# EasyEDA Pro project ProPrj_3x3motorFPGA_2025-06-22.epro, schematic Current_shunt_ADC
Create Date: 2025-06-07; Page Name: P1; Project Name: 3x3motorFPGA; Schematic Name: Current_shunt_ADC; Update Date: 2025-06-09; Company: EasyEDA.com; Page Size: A4; Version: V1.0
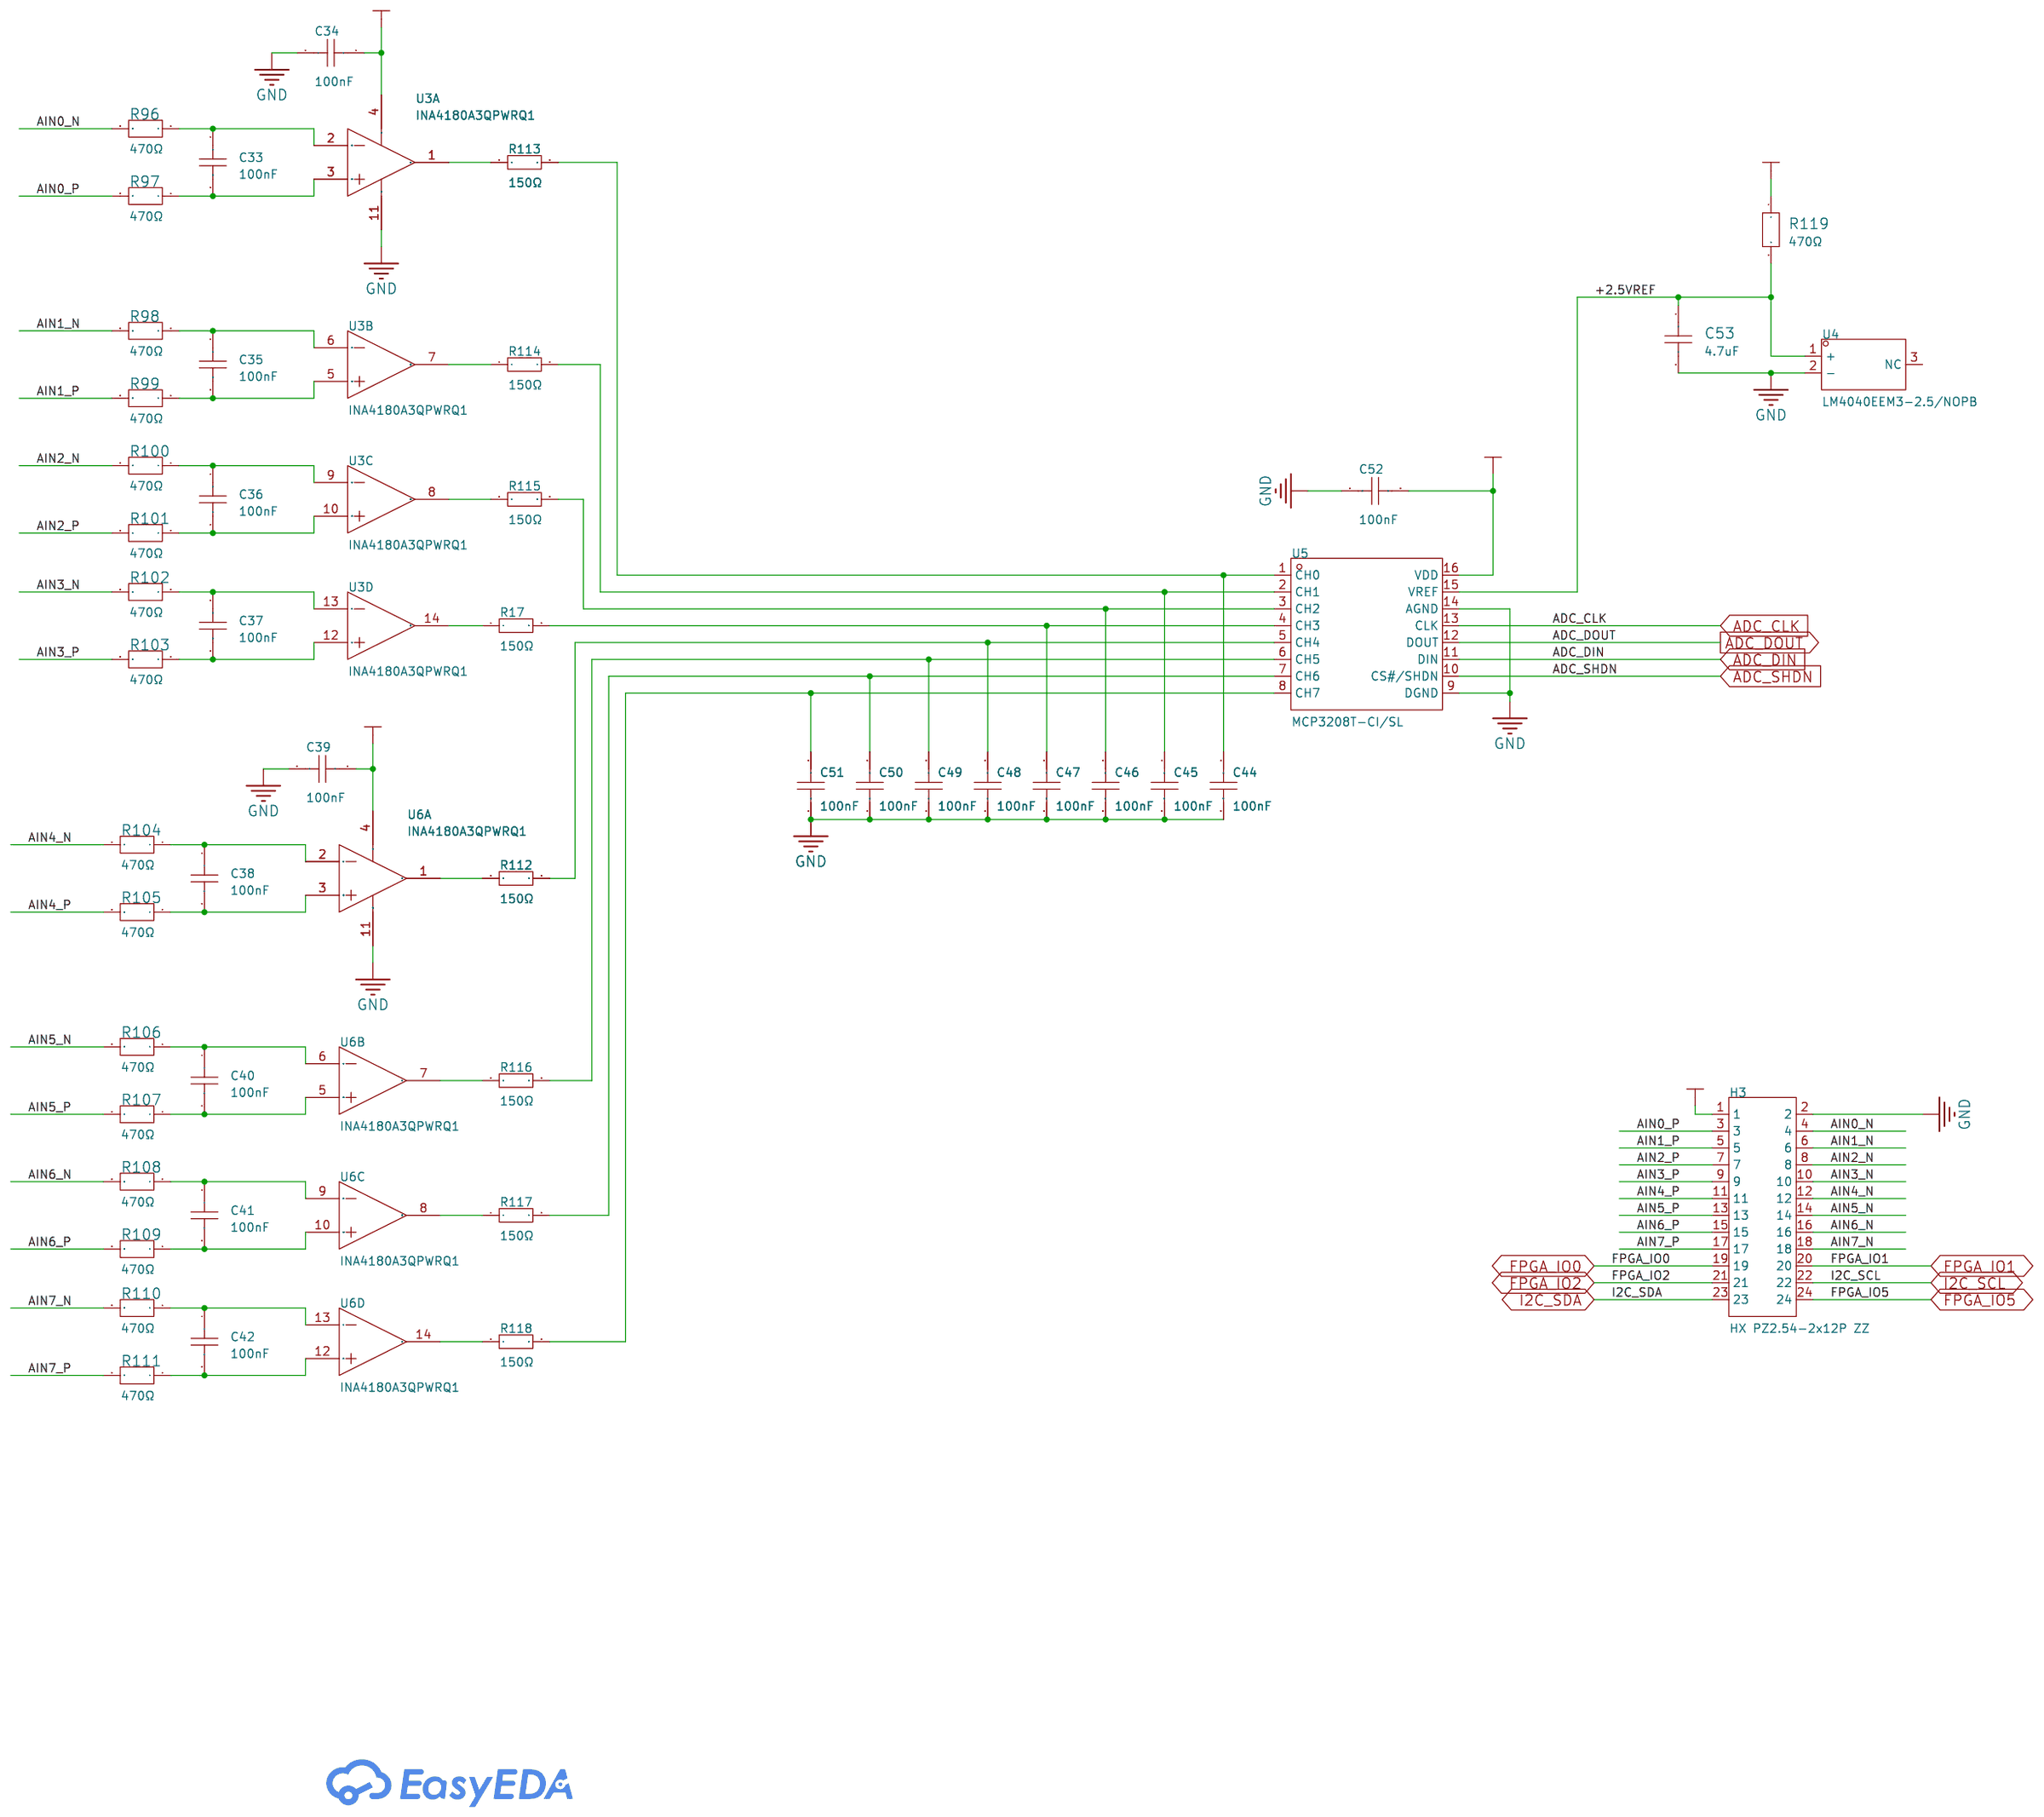
[diagram p2: schematic sheet]

## Parts
C33  100nF  [C0402]
C34  100nF  [C0402]
C35  100nF  [C0402]
C36  100nF  [C0402]
C37  100nF  [C0402]
C38  100nF  [C0402]
C39  100nF  [C0402]
C40  100nF  [C0402]
C41  100nF  [C0402]
C42  100nF  [C0402]
C44  100nF  [C0402]
C45  100nF  [C0402]
C46  100nF  [C0402]
C47  100nF  [C0402]
C48  100nF  [C0402]
C49  100nF  [C0402]
C50  100nF  [C0402]
C51  100nF  [C0402]
C52  100nF  [C0402]
C53  4.7uF  [C0402]
H3  HX PZ2.54-2x12P ZZ  [HDR-TH_24P-P2.54-V-M-R2-C12-S2.54]
R17  150Ω  [R0402]
R96  470Ω  [R0402]
R97  470Ω  [R0402]
R98  470Ω  [R0402]
R99  470Ω  [R0402]
R100  470Ω  [R0402]
R101  470Ω  [R0402]
R102  470Ω  [R0402]
R103  470Ω  [R0402]
R104  470Ω  [R0402]
R105  470Ω  [R0402]
R106  470Ω  [R0402]
R107  470Ω  [R0402]
R108  470Ω  [R0402]
R109  470Ω  [R0402]
R110  470Ω  [R0402]
R111  470Ω  [R0402]
R112  150Ω  [R0402]
R113  150Ω  [R0402]
R114  150Ω  [R0402]
R115  150Ω  [R0402]
R116  150Ω  [R0402]
R117  150Ω  [R0402]
R118  150Ω  [R0402]
R119  470Ω  [R0402]
U3  INA4180A3QPWRQ1  [TSSOP-14_L5.0-W4.4-P0.65-LS6.4-BL]  (sections 1,2,3,4)
U4  LM4040EEM3-2.5/NOPB  [SOT-23-3_L2.9-W1.3-P1.90-LS2.4-BR]
U5  MCP3208T-CI/SL  [SOIC-16_L9.9-W3.9-P1.27-LS6.0-BL]
U6  INA4180A3QPWRQ1  [TSSOP-14_L5.0-W4.4-P0.65-LS6.4-BL]  (sections 1,2,3,4)

## Library data of the parts
C33-C42 C44-C52 = CL05B104KB54PNC: Capacitance: Tolerance:±10% Tolerance:±10% Voltage Rated: Temperature Coefficient:; LCSC Part Name: 100nF ±10% 50V; Supplier Part: C307331; Manufacturer: SAMSUNG(三星); Supplier Footprint: 0402; JLCPCB Part Class: Basic Part; Datasheet: https://atta.szlcsc.com/upload/public/pdf/source/20160218/1457707763339.pdf; Supplier: LCSC; Tolerance: ±10%; Check: true
C53 = LMK105BBJ475MVLF: Capacitance: Tolerance:±20% Tolerance:±20% Voltage Rated: Temperature Coefficient:; LCSC Part Name: 4.7uF ±20% 10V; Supplier Part: C386043; Manufacturer: TAIYO YUDEN(太诱); Supplier Footprint: 0402; JLCPCB Part Class: Extended Part; Datasheet: https://atta.szlcsc.com/upload/public/pdf/source/20210525/C2802164_C0429B055888A674C3F00BA74B841C5B.pdf; Supplier: LCSC; Tolerance: ±20%; Check: true
H3 = HX PZ2.54-2x12P ZZ: Pin Structure:2x12P Pitch:2.54mm Row Spacing:2.54mm Circluar Pins/Square Pins:Policy Number of Rows:Double Row Number of Pins:24P Current Rating:3A Length of Mating Pin:6mm Insulation Height:2.5mm Length of End Connection Pin:3mm Contact Plating:Gold Oper; LCSC Part Name: 间距:2.54mm 2x12P 直针; Supplier Part: C42372520; Manufacturer: hanxia(韩下); Supplier Footprint: 插件,P=2.54mm; Datasheet: https://atta.szlcsc.com/upload/public/pdf/source/20241030/FABA9924355EF3ED6720AD656562B1EA.pdf; Supplier: LCSC; Pin Structure: 2x12P; Pitch: 2.54mm; Row Spacing: 2.54mm; Circluar Pins/Square Pins: Policy; Number of Rows: Double Row; Number of Pins: 24P; Current Rating: 3A; Length of Mating Pin: 6mm; Insulation Height: 2.5mm; Length of End Connection Pin: 3mm; Contact Plating: Gold; Operating Temperature: -40℃~+105℃; Color: Black; Check: true
R17 R112-R118 = 0402WGF1500TCE: Type:Thick Film Resistors Resistance: Tolerance:±1% Tolerance:±1% Power(Watts): Overload Voltage (Max): Temperature Coefficient:±100ppm/℃ Temperature Coefficient:±100ppm/℃ Operating Temperature Range:-55℃~+155℃ Operating Temperature Range:-55℃~+155℃; LCSC Part Name: 150Ω ±1% 62.5mW 厚膜电阻; Supplier Part: C25082; Manufacturer: UNI-ROYAL(厚声); Supplier Footprint: 0402; JLCPCB Part Class: Extended Part; Datasheet: https://atta.szlcsc.com/upload/public/pdf/source/20200306/C422600_1E6D84923E4A46A82E41ADD87F860B5C.pdf; Supplier: LCSC; Type: Thick Film Resistors; Tolerance: ±1%; Temperature Coefficient: ±100ppm/℃; Operating Temperature Range: -55℃~+155℃
R96-R111 R119 = ERJ2RKF4700X: Type:Thick Film Resistors Resistance: Tolerance:±1% Tolerance:±1% Power(Watts): Overload Voltage (Max):- Temperature Coefficient:±100ppm/℃ Temperature Coefficient:±100ppm/℃ Operating Temperature Range:-55℃~+155℃ Operating Temperature Range:-55℃~+155℃; LCSC Part Name: 470Ω ±1% 100mW 厚膜电阻; Supplier Part: C413076; Manufacturer: PANASONIC(松下); Supplier Footprint: 0402; JLCPCB Part Class: Extended Part; Datasheet: https://atta.szlcsc.com/upload/public/pdf/source/20190820/C413076_A251B47E5333B76045B2C8CB73904275.pdf; Supplier: LCSC; Type: Thick Film Resistors; Tolerance: ±1%; Temperature Coefficient: ±100ppm/℃; Operating Temperature Range: -55℃~+155℃
U3 U6 = INA4180A3QPWRQ1: Number of Channels:单路 Operating Temperature:-40℃~+125℃ Operating Temperature:-40℃~+125℃; Supplier Part: C2866762; Manufacturer: TI(德州仪器); Supplier Footprint: TSSOP-14; JLCPCB Part Class: Extended Part; Datasheet: https://www.ti.com/cn/lit/gpn/ina2180-q1; Supplier: LCSC; Number of Channels: 单路; Operating Temperature: -40℃~+125℃
U4 = LM4040EEM3-2.5/NOPB: Output Type:Fixed Input Voltage:- Input Voltage:- Output Voltage:2.5V Output Voltage:2.5V Output Current:15mA Tolerance:±2% Tolerance:±2% Temperature Coefficient:150ppm/℃ Reference Type:parallel connection Supply Current:- Minimum Cathode Current for Regu; Supplier Part: C205908; Manufacturer: TI(德州仪器); Supplier Footprint: SOT-23; JLCPCB Part Class: Extended Part; Datasheet: https://www.ti.com/cn/lit/gpn/lm4040-n; Supplier: LCSC; Output Type: Fixed; Output Voltage: 2.5V; Output Current: 15mA; Tolerance: ±2%; Temperature Coefficient: 150ppm/℃; Reference Type: parallel connection; Minimum Cathode Current for Regulation: 73uA; Noise - 10Hz to 10kHz: 35uVrms; Operating Temperature: -40℃~+125℃@(Ta)
U5 = MCP3208T-CI/SL: Resolution(Bits):12Bit Sampling Rate:100kHz number of channels:8 Voltage - Supply:2.7V~5.5V Voltage - Supply:2.7V~5.5V Interface:SPI；serial differential input:- Integral non - linearity:2LSB Integral non - linearity:2LSB Operating Temperature:-40℃~+85℃ Op; Supplier Part: C626764; Manufacturer: MICROCHIP(美国微芯); Supplier Footprint: SOIC-16; JLCPCB Part Class: Extended Part; Datasheet: https://atta.szlcsc.com/upload/public/pdf/source/20140724/1457707162058.pdf; Supplier: LCSC; Resolution(Bits): 12Bit; Sampling Rate: 100kHz; number of channels: 8; Voltage - Supply: 2.7V~5.5V; Interface: SPI；serial; Integral non - linearity: 2LSB; Operating Temperature: -40℃~+85℃

## Nets
3.3V: C34.1 C39.1 C52.2 H3.1 R119.1 U3.4(VS) U5.16(VDD) U6.4(VS)
+2.5VREF: C53.1 R119.2 U4.1(+) U5.15(VREF)
GND: C34.2 C39.2 C44.2 C45.2 C46.2 C47.2 C48.2 C49.2 C50.2 C51.2 C52.1 C53.2 H3.2 U3.11(GND) U4.2(-) U5.9(DGND) U5.14(AGND) U6.11(GND)
ADC_CLK: U5.13(CLK)
ADC_DIN: U5.11(DIN)
ADC_DOUT: U5.12(DOUT)
ADC_SHDN: U5.10(CS#/SHDN)
AIN0_N: H3.4 R96.2
AIN0_P: H3.3 R97.2
AIN1_N: H3.6 R98.2
AIN1_P: H3.5 R99.2
AIN2_N: H3.8 R100.2
AIN2_P: H3.7 R101.2
AIN3_N: H3.10 R102.2
AIN3_P: H3.9 R103.2
AIN4_N: H3.12 R104.2
AIN4_P: H3.11 R105.2
AIN5_N: H3.14 R106.2
AIN5_P: H3.13 R107.2
AIN6_N: H3.16 R108.2
AIN6_P: H3.15 R109.2
AIN7_N: H3.18 R110.2
AIN7_P: H3.17 R111.2
FPGA_IO0: H3.19
FPGA_IO1: H3.20
FPGA_IO2: H3.21
FPGA_IO5: H3.24
I2C_SCL: H3.22
I2C_SDA: H3.23
Net-(C33-1): C33.1 R96.1 U3.2(IN–1)
Net-(C33-2): C33.2 R97.1 U3.3(IN+1)
Net-(C35-1): C35.1 R98.1 U3.6(IN–2)
Net-(C35-2): C35.2 R99.1 U3.5(IN+2)
Net-(C36-1): C36.1 R100.1 U3.9(IN–3)
Net-(C36-2): C36.2 R101.1 U3.10(IN+3)
Net-(C37-1): C37.1 R102.1 U3.13(IN–4)
Net-(C37-2): C37.2 R103.1 U3.12(IN+4)
Net-(C38-1): C38.1 R104.1 U6.2(IN–1)
Net-(C38-2): C38.2 R105.1 U6.3(IN+1)
Net-(C40-1): C40.1 R106.1 U6.6(IN–2)
Net-(C40-2): C40.2 R107.1 U6.5(IN+2)
Net-(C41-1): C41.1 R108.1 U6.9(IN–3)
Net-(C41-2): C41.2 R109.1 U6.10(IN+3)
Net-(C42-1): C42.1 R110.1 U6.13(IN–4)
Net-(C42-2): C42.2 R111.1 U6.12(IN+4)
Net-(C44-1): C44.1 R113.2 U5.1(CH0)
Net-(C45-1): C45.1 R114.2 U5.2(CH1)
Net-(C46-1): C46.1 R115.2 U5.3(CH2)
Net-(C47-1): C47.1 R17.2 U5.4(CH3)
Net-(C48-1): C48.1 R112.2 U5.5(CH4)
Net-(C49-1): C49.1 R116.2 U5.6(CH5)
Net-(C50-1): C50.1 R117.2 U5.7(CH6)
Net-(C51-1): C51.1 R118.2 U5.8(CH7)
Net-(R17-1): R17.1 U3.14(OUT4)
Net-(R112-1): R112.1 U6.1(OUT 1)
Net-(R113-1): R113.1 U3.1(OUT 1)
Net-(R114-1): R114.1 U3.7(OUT2)
Net-(R115-1): R115.1 U3.8(OUT3)
Net-(R116-1): R116.1 U6.7(OUT2)
Net-(R117-1): R117.1 U6.8(OUT3)
Net-(R118-1): R118.1 U6.14(OUT4)

Not connected (* = marked no-connect by the designer): U4 3(NC)
